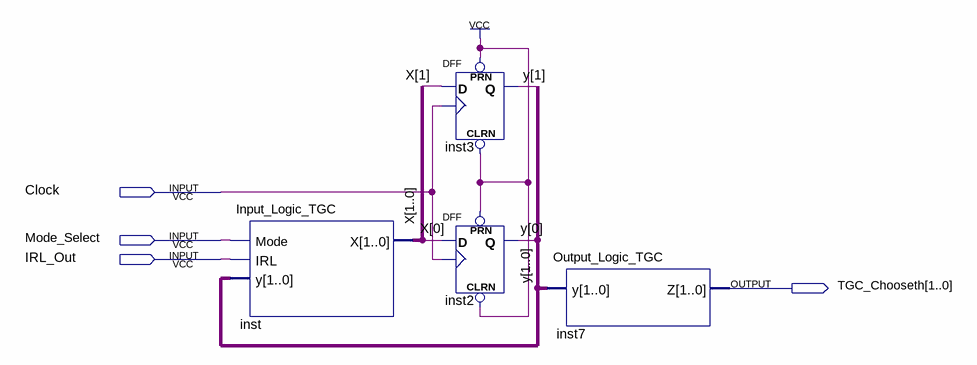
[diagram p0: schematic sheet]
// Quartus schematic TGC_Machine.bdf as structural Verilog: 4 symbols, 4 pins
module TGC_Machine (
  input  Clock,
  input  Mode_Select,
  input  IRL_Out,
  output [1:0] TGC_Chooseth
);

  wire [1:0] X, y;

  Input_Logic_TGC inst (.Mode(Mode_Select), .IRL(IRL_Out), .y(y), .X(X));
  DFF inst3 (.CLRN(1'b1), .CLK(Clock), .D(X[1]), .PRN(1'b1), .Q(y[1]));
  DFF inst2 (.CLRN(1'b1), .CLK(Clock), .D(X[0]), .PRN(1'b1), .Q(y[0]));
  Output_Logic_TGC inst7 (.y(y), .Z(TGC_Chooseth));
endmodule
